# EAGLE design adc (EAGLE 4.16)
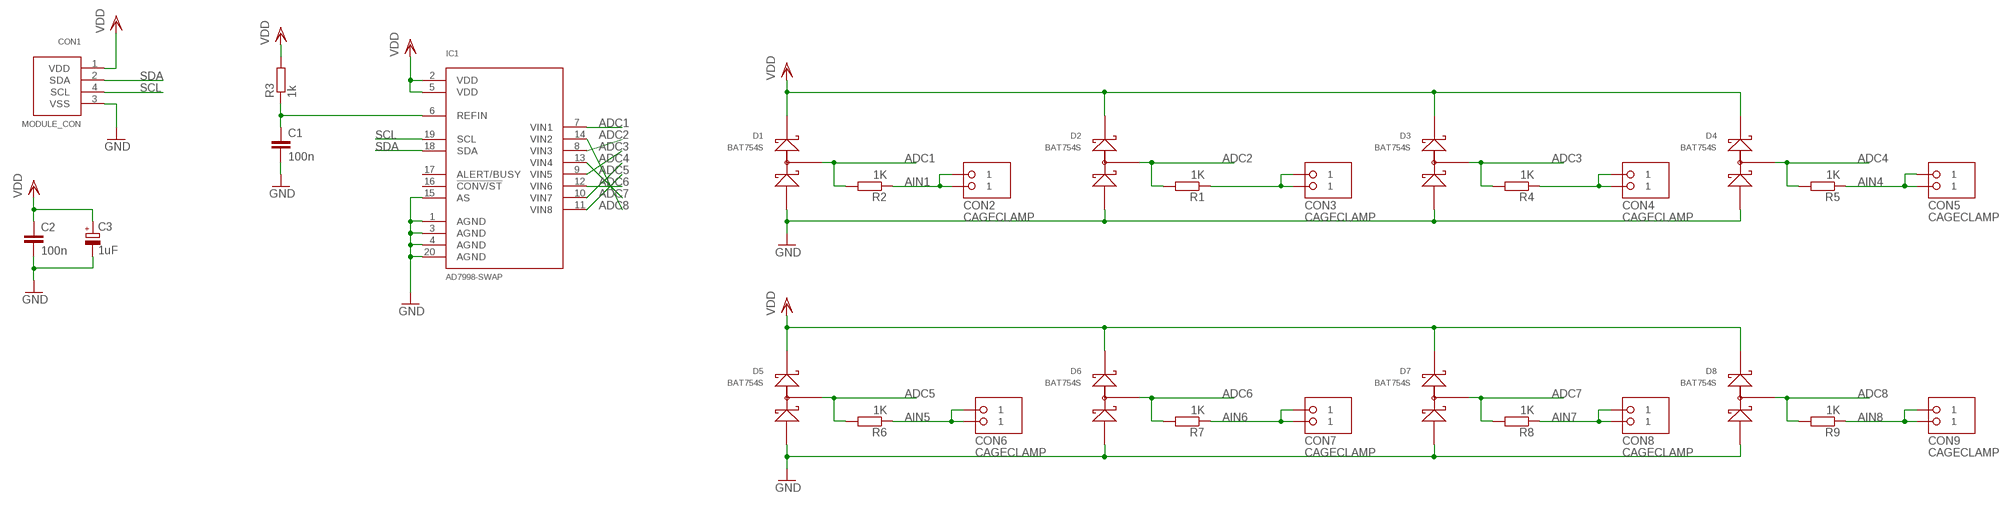
[diagram p0: schematic, sheet 1]

## Parts
C1  100n  C-EUC0603  [C0603]
C2  100n  C-EUC0603  [C0603]
C3  1uF  CPOL-EUB45181A  [B45181A]
CON1  MODULE_CON  [RJ11]
CON2  CAGECLAMP  [CAGECLAMP]
CON3  CAGECLAMP  [CAGECLAMP]
CON4  CAGECLAMP  [CAGECLAMP]
CON5  CAGECLAMP  [CAGECLAMP]
CON6  CAGECLAMP  [CAGECLAMP]
CON7  CAGECLAMP  [CAGECLAMP]
CON8  CAGECLAMP  [CAGECLAMP]
CON9  CAGECLAMP  [CAGECLAMP]
D1  BAT754S  [SOT23]
D2  BAT754S  [SOT23]
D3  BAT754S  [SOT23]
D4  BAT754S  [SOT23]
D5  BAT754S  [SOT23]
D6  BAT754S  [SOT23]
D7  BAT754S  [SOT23]
D8  BAT754S  [SOT23]
IC1  AD7998-SWAP  [TSSOP20]
R1  1K  R-EU_M1206  [M1206]
R2  1K  R-EU_M1206  [M1206]
R3  1k  R-EU_M1206  [M1206]
R4  1K  R-EU_M1206  [M1206]
R5  1K  R-EU_M1206  [M1206]
R6  1K  R-EU_M1206  [M1206]
R7  1K  R-EU_M1206  [M1206]
R8  1K  R-EU_M1206  [M1206]
R9  1K  R-EU_M1206  [M1206]

## Nets
ADC1: D1.3(MID) IC1.7(VIN1) R2.2
ADC2: D2.3(MID) IC1.8(VIN3) R1.2
ADC3: D3.3(MID) IC1.9(VIN5) R4.2
ADC4: D4.3(MID) IC1.10(VIN7) R5.2
ADC5: D5.3(MID) IC1.11(VIN8) R6.2
ADC6: D6.3(MID) IC1.12(VIN6) R7.2
ADC7: D7.3(MID) IC1.13(VIN4) R8.2
ADC8: D8.3(MID) IC1.14(VIN2) R9.2
AIN1: CON2.1 CON2.2 R2.1
AIN4: CON5.1 CON5.2 R5.1
AIN5: CON6.1 CON6.2 R6.1
AIN6: CON7.1 CON7.2 R7.1
AIN7: CON8.1 CON8.2 R8.1
AIN8: CON9.1 CON9.2 R9.1
GND: C1.2 C2.2 C3.- CON1.3(VSS) D1.1(ANODE) D2.1(ANODE) D3.1(ANODE) D4.1(ANODE) D5.1(ANODE) D6.1(ANODE) D7.1(ANODE) D8.1(ANODE) IC1.1(AGND) IC1.3(AGND) IC1.4(AGND) IC1.15(AS) IC1.20(AGND)
N$1: CON3.1 CON3.2 R1.1
N$2: C1.1 IC1.6(REFIN) R3.1
N$3: CON4.1 CON4.2 R4.1
SCL: CON1.4(SCL) IC1.19(SCL)
SDA: CON1.2(SDA) IC1.18(SDA)
VDD: C2.1 C3.+ CON1.1(VDD) D1.2(CATHODE) D2.2(CATHODE) D3.2(CATHODE) D4.2(CATHODE) D5.2(CATHODE) D6.2(CATHODE) D7.2(CATHODE) D8.2(CATHODE) IC1.2(VDD) IC1.5(VDD) R3.2
Unconnected: IC1.16(!CONV/ST) IC1.17(ALERT/BUSY)

## Library data of the parts
C1 C2 = rcl:C-EU: CAPACITOR, European symbol
C3 = rcl:CPOL-EU: POLARIZED CAPACITOR, European symbol
CON1 = ecssr:MODULE_CON
CON2-CON9 = ecssr:CAGECLAMP
D1-D8 = ecssr:BAT754S
IC1 = ecssr:AD7998-SWAP
R1-R9 = rcl:R-EU_: RESISTOR, European symbol

## Board
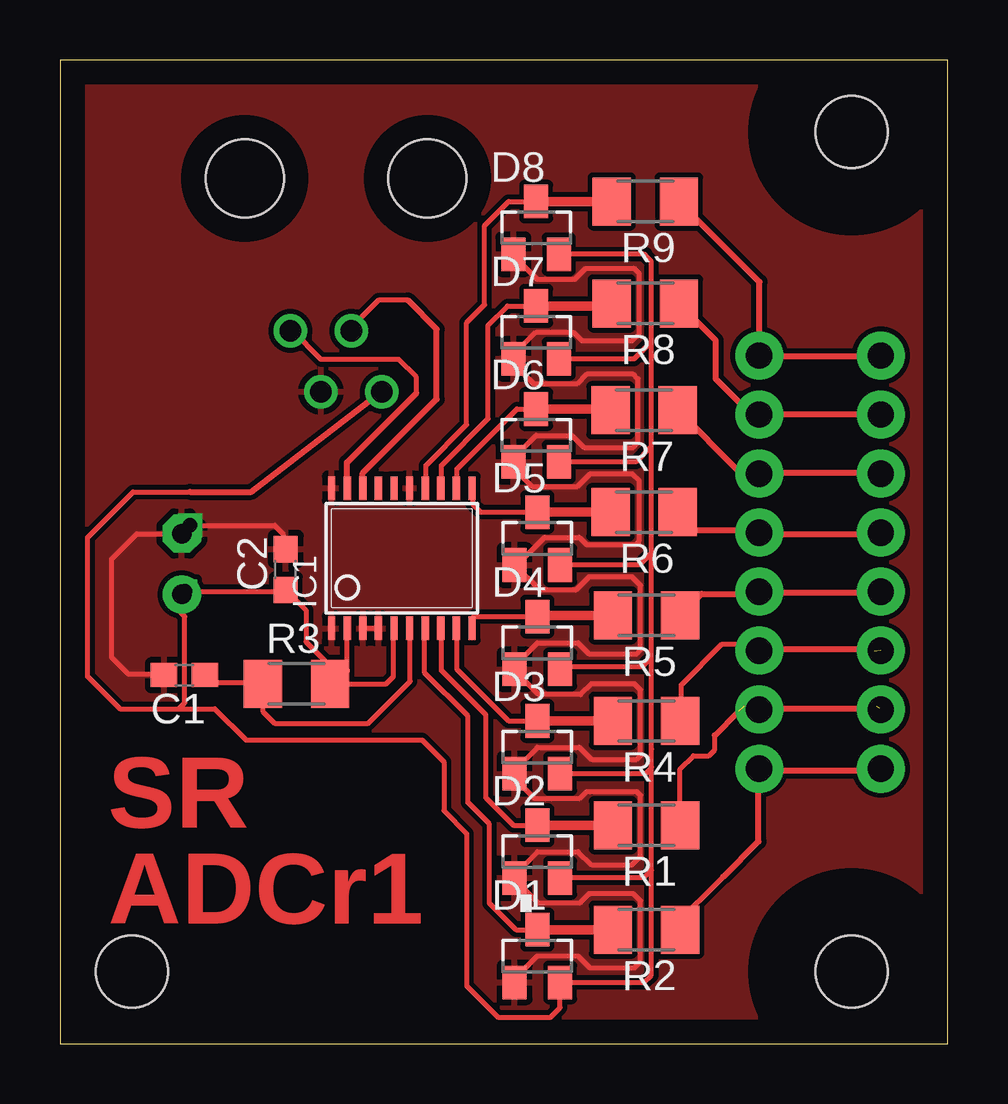
[diagram p1: board, top side]
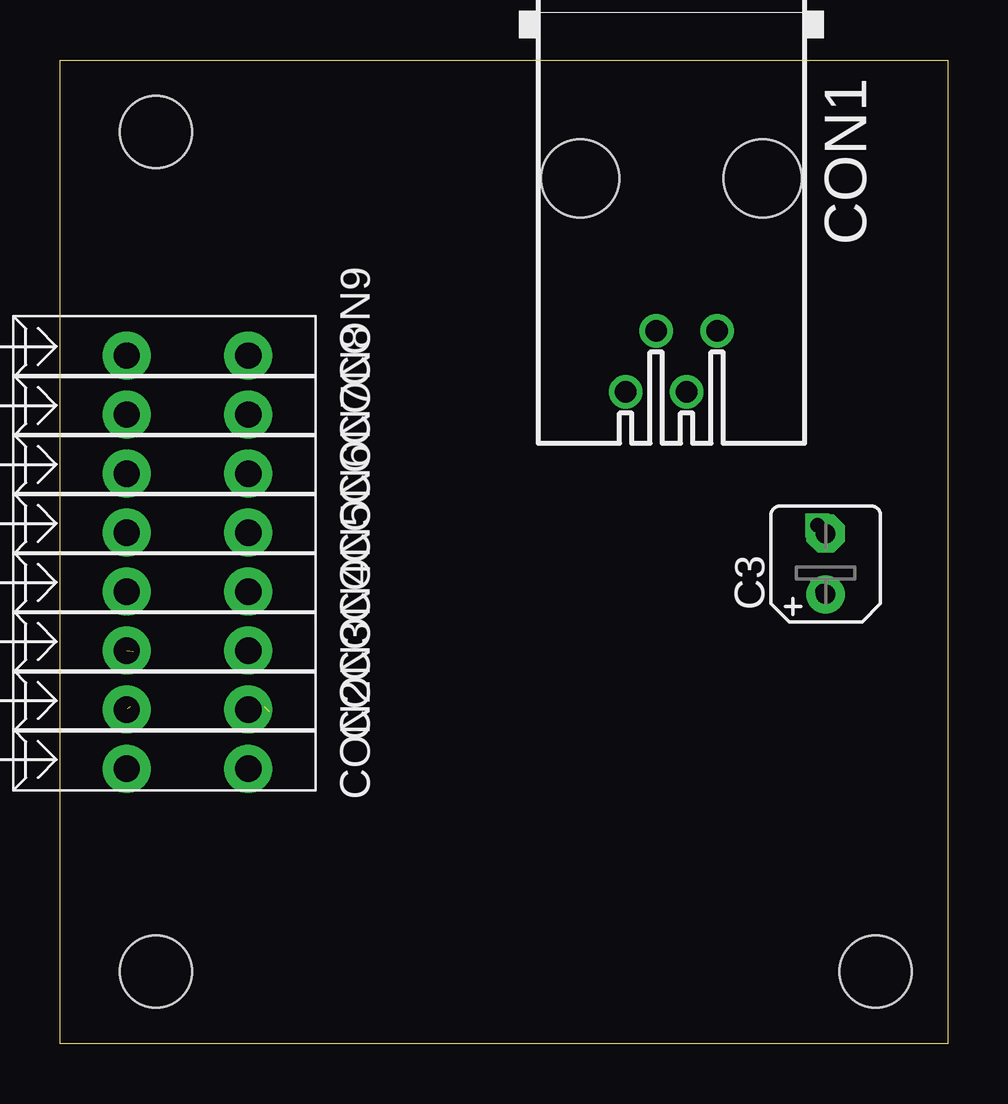
[diagram p2: board, bottom side, seen from below]

Size 37 x 41 mm. Coordinates in mm from the lower left corner, seen from the top.
Outline: 0,0 37,0 37,41 0,41 0,0
Copper layers (1*16): Top 0.035mm / dielectric 1.5mm / Bottom 0.035mm
Design rules "default": minimum track width 10mil, minimum drill 24mil, track to track 8mil, track to pad 8mil, pad to pad 8mil, via to via 8mil, smd to smd 8mil, copper to edge 40mil, drill to drill 8mil, minimum pad ring 10mil, minimum via ring 8mil, stop-mask expansion 4mil, vias tented up to drill 0mil, thermal gap 10mil
Holes 3 mm at 3,3 33,3 33,38
tRestrict: area 29,34 to 37,42; area 29,-1 to 37,7

### Footprints (pad centres in the part's own frame; a part is rotated, then mirrored left to right if it is on the bottom)
C0603 = smd 1.1 x 1: 1 -0.85,0; 2 0.85,0
B45181A = drill 0.813 pad 1.6 round: + -1.27,0 | drill 0.813 pad 1.6 octagon: - 1.27,0
RJ11-4P4C = drill 0.889 round: 1 1.905,8.89; 2 0.635,6.35; 3 -0.635,8.89; 4 -1.905,6.35 | hole 3.251: -3.81,0; 3.81,0
CAGECLAMP = drill 1.1 pad 2 round: 1 0,-0.01; 2 0,-5.08
SOT23 = smd 1 x 1.4: 1 -0.95,-1.1; 2 0.95,-1.1; 3 0,1.1
TSSOP20 = smd 0.305 x 0.991: 1 -2.925,-2.918; 2 -2.275,-2.918; 3 -1.625,-2.918; 4 -0.975,-2.918; 5 -0.325,-2.918; 6 0.325,-2.918; 7 0.975,-2.918; 8 1.625,-2.918; 9 2.275,-2.918; 10 2.925,-2.918; 11 2.925,2.918; 12 2.275,2.918; 13 1.625,2.918; 14 0.975,2.918; 15 0.325,2.918; 16 -0.325,2.918; 17 -0.975,2.918; 18 -1.625,2.918; 19 -2.275,2.918; 20 -2.925,2.918
M1206 = smd 1.6 x 2: 1 -1.4,0; 2 1.4,0

### Placement (x,y rotation side)
C1  5.19,15.36 180 top
C2  9.41,19.76 90 top
C3  5.08,19.99 90 bottom
CON1  MODULE_CON  [RJ11-4P4C]  11.51,36.06 180 bottom
CON2  34.23,11.46 90 bottom
CON3  34.23,13.92 90 bottom
CON4  34.23,16.38 90 bottom
CON5  34.23,18.84 90 bottom
CON6  34.23,21.3 90 bottom
CON7  34.23,23.76 90 bottom
CON8  34.23,26.22 90 bottom
CON9  34.23,28.68 90 bottom
D1  19.9,3.65 0 top
D2  19.9,8 0 top
D3  19.9,12.35 0 top
D4  19.9,16.7 0 top
D5  19.9,21.05 0 top
D6  19.85,25.35 0 top
D7  19.85,29.65 0 top
D8  19.85,34 0 top
IC1  14.25,20.23 0 top
R1  24.45,9.1 180 top
R2  24.45,4.75 180 top
R3  9.86,15 0 top
R4  24.45,13.45 180 top
R5  24.45,17.85 180 top
R6  24.35,22.15 180 top
R7  24.35,26.4 180 top
R8  24.4,30.85 180 top
R9  24.4,35.1 180 top

### Tracks (layer width: path | path; a pad name or v marks a point on that pad's centre or on a via)
ADC1
  Top 0.2: D1.3 19,4.75 17.9,5.85 17.9,9.15 17,10.05 17,13.65 15.2,15.45 15.2,17.15 15.25,17.2 15.23,17.23 IC1.7
  Top 0.4: D1.3 R2.2
ADC2
  Top 0.2: D2.3 18.9,9.1 17.75,10.25 17.75,13.7 15.9,15.55 15.9,17.1 15.88,17.12 IC1.8
  Top 0.4: D2.3 R1.2
ADC3
  Top 0.2: D3.3 18.7,13.45 16.55,15.6 16.55,17.25 16.52,17.27 IC1.9
  Top 0.4: D3.3 R4.2
ADC4
  Top 0.2: IC1.10 17.17,17.68 17.15,17.7 17.25,17.8 D4.3
  Top 0.4: 23.2,17.85 R5.2 19.95,17.85 D4.3
ADC5
  Top 0.2: D5.3 17.55,22.15 17.2,22.5 17.2,23.1 17.17,23.12 IC1.11
  Top 0.4: 23.05,22.15 R6.2 23.05,22.15 | 23.05,22.15 23.03,22.17 | D5.3 23.05,22.15
ADC6
  Top 0.2: R7.2 22.74,26.39 22.75,26.4 22.72,26.43 | D6.3 19.05,26.45 16.55,23.95 16.55,23.15 IC1.12
  Top 0.4: 23,26.45 R7.2 | D6.3 23,26.45 | 23,26.45 23.05,26.5
ADC7
  Top 0.2: R8.2 22.62,30.77 22.6,30.75 | D7.3 18.65,30.75 17.85,29.95 17.85,26.05 15.9,24.1 15.9,22.9 15.88,22.93 IC1.13
  Top 0.4: D7.3 22.6,30.75
ADC8
  Top 0.2: D8.3 18.7,35.1 17.7,34.1 17.7,30.8 16.95,30.05 16.95,25.8 15.25,24.1 15.25,23 15.23,23.02 IC1.14
  Top 0.4: 23.05,35.1 R9.2 D8.3
AIN1
  Top 0.2: 27.65,6.95 25.6,4.9 25.15,4.9 25.4,4.65 25.85,4.65 R2.1
  Top 0.25: 29.12,11.49 29.12,11.56 | 29.12,11.49 CON2.2 29.23,11.38 34.3,11.38 | 27.65,6.95 29.12,8.42 29.12,11.49 | 34.3,11.38 34.36,11.38 | 34.3,11.38 CON2.1
AIN4
  Top 0.25: R5.1 26.74,18.74 29.14,18.74 CON5.2 29.19,18.8 34.26,18.8 | 34.26,18.8 | 34.26,18.8 CON5.1
AIN5
  Top 0.25: CON6.2 29.16,21.4 26.5,21.4 R6.1 | CON6.2 | 34.28,21.24 | 34.28,21.24 CON6.1 | CON6.2 29.23,21.24 34.28,21.24
AIN6
  Top 0.25: 29.23,23.84 29.3,23.84 29.34,23.8 34.26,23.8 | CON7.2 29.23,23.84 | R7.1 28.31,23.84 29.23,23.84 | 34.26,23.8 34.34,23.8 | 34.26,23.8 CON7.1
AIN7
  Top 0.25: R8.1 27.34,29.31 27.34,27.7 28.8,26.24 29.13,26.24 | CON8.2 29.13,26.24 | 34.24,26.24 34.68,26.24 | 34.24,26.24 CON8.1 | 29.13,26.24 34.24,26.24
AIN8
  Top 0.25: CON9.2 | R9.1 29.16,31.74 CON9.2 | 34.24,28.66 34.56,28.66 | 34.24,28.66 CON9.1 | CON9.2 29.18,28.66 34.24,28.66
GND  (via drill 0.6)
  Top 0.2: 20.75,29.65 19.85,29.65 18.9,28.7 18.9,28.53 | 20.75,29.65 20.85,29.65 | 18.9,28.53 18.9,28.5 | 18.9,28.53 D7.1 18.8,28.45 19.75,27.5 21.55,27.5 21.95,27.9 23.9,27.9 24.1,27.7 24.1,25.05 23.9,24.85 21.85,24.85 21.35,25.35 19.85,25.35 18.89,24.39 D6.1 18.89,24.01 19.7,23.2 21.55,23.2 22.1,23.75 23.85,23.75 24.15,23.45 24.15,20.95 24,20.8 21.95,20.8 21.65,21.1 20.2,21.1 19.3,20.2 19.3,19.98 D5.1 20.01,18.9 21.5,18.9 22.05,19.45 23.85,19.45 24.2,19.1 24.2,16.4 24.05,16.25 22.05,16.25 21.6,16.7 19.9,16.7 18.9,15.7 18.9,15.65 | 19.25,33 19.25,32.97 D8.1 | 20.75,29.65 21.4,29.65 21.75,29.3 23.85,29.3 24.15,29.6 24.15,32.1 23.95,32.3 21.9,32.3 21.45,31.85 19.9,31.85 19.25,32.5 19.25,33.32 | 19.25,33.32 19.25,33.35 | 19.25,33.32 D8.1 | 18.9,15.65 D4.1 | 18.9,15.65 18.9,15.6 19.95,14.55 21.7,14.55 22.15,15 23.95,15 24.2,14.75 24.2,12 24.05,11.85 22.15,11.85 21.65,12.35 19.9,12.35 18.95,11.4 D3.1 18.95,11.05 19.8,10.2 21.65,10.2 21.95,10.5 24.05,10.5 24.2,10.35 24.2,7.8 23.85,7.45 22.15,7.45 21.6,8 19.9,8 18.95,7.05 D2.1 18.95,6.85 19.95,5.85 21.65,5.85 22.05,6.25 23.9,6.25 24.2,5.95 24.2,3.4 23.95,3.15 22.1,3.15 21.6,3.65 19.9,3.65 18.9,2.65 18.95,2.6 D1.1 18.9,2.6 | D8.1 19.05,33.05 19.05,33.2 | IC1.4 12.64,17.3 IC1.3 | v5.42,21.6 8.95,21.6 9.3,21.25 9.3,20.7 9.32,20.7 C2.2 | v5.07,21.25 3.2,21.25 2.15,20.2 2.15,16.1 2.85,15.4 4.3,15.4 C1.2
  Bottom 0.2: v5.42,21.6 C3.- v5.07,21.25
  pour Top (isolate 0.2): -2,44 41,44 41,-3 -2,-3
N$1  (2 unrouted)
  Top 0.2: R1.1 25.85,11.45 26.4,12 27.05,12 27.3,12.25 27.3,12.85 | 28.5,14.05 28.72,14.05 | 33.76,14.26 33.8,14.3 34.05,14.05
  Top 0.25: 29.23,13.84 29.28,13.84 29.4,13.96 34.18,13.96 CON3.1 | 29.23,13.84 CON3.2 | 27.3,12.85 28.29,13.84 29.23,13.84
N$2
  Top 0.2: IC1.6 14.58,17.27 14.6,17.25 14.6,15.1 12.85,13.35 8.95,13.35 8.45,13.85 8.45,15.15 8.46,15.14 R3.1 | R3.1 8.6,14.86 | 8.51,15.05 8.7,15.05 | 8.51,15.05 R3.1 | C1.1 6.35,15.05 8.51,15.05
N$3  (1 unrouted)
  Top 0.2: R4.1 25.9,13.5 25.9,14.95 27.6,16.65 28.66,16.65 | 33.95,16.35 33.76,16.54
  Top 0.25: 28.66,16.65 29.05,16.26 29.08,16.26 29.08,16.31 CON4.2 29.21,16.44 34.28,16.44 | 34.28,16.44 34.3,16.44 | 34.28,16.44 CON4.1
SCL
  Top 0.2: 14.86,27.12 14.86,27.78 14.12,28.52 10.88,28.52 9.69,29.71 CON1.4
  Top 0.25: 14.86,27.12 11.96,24.22 11.96,23.2 11.98,23.18 IC1.19
SDA
  Top 0.2: 12.65,23.15 IC1.18 | 12.6,23.4 12.62,23.38 IC1.18 | 12.6,23.6 12.62,23.57 IC1.18 | CON1.2 12.15,29.8 12.12,29.82 13.28,30.98 14.5,30.98
  Top 0.25: 14.5,30.98 15.7,29.78 15.7,26.86 12.62,23.78 12.62,23.4 12.58,23.36 12.62,23.32 IC1.18
VDD  (via drill 0.6)
  Top 0.2: 20.8,28.53 20.8,28.5 | 20.8,28.53 D7.2 | 24.65,29.15 24.6,29.2 23.93,28.53 20.8,28.53 | 21.15,33.05 21,33.2 21.11,33.31 D8.2 20.85,32.95 20.9,32.9 24.35,32.9 | D6.2 24,24.25 24.6,24.85 24.65,24.75 | 24.65,24.75 24.65,29.15 | D5.2 24.15,19.95 24.65,20.45 24.65,20.5 | 24.65,20.5 24.65,24.75 | D4.2 20.91,15.7 24.25,15.7 24.65,16.1 | 24.65,16.1 24.65,20.5 | 24.65,12.3 24.65,16.1 | 24.65,12.3 24.65,12.25 | D3.2 24.4,11.25 24.65,11.5 24.65,11.55 | 24.65,11.55 24.65,12.3 | 24.65,7.25 24.65,7.2 24.35,6.9 D2.2 | 24.65,7.25 24.65,11.55 | 24.65,7.25 24.65,2.85 24.35,2.55 D1.2 20.85,1.5 20.45,1.1 18.25,1.1 16.95,2.4 16.95,8.75 16,9.7 16,11.75 15.1,12.65 7.75,12.65 6.45,13.95 4.95,13.95 | 24.65,29.15 24.65,32.6 24.35,32.9 | R3.2 11.26,14.86 arc-90 11.25,14.85 arc90 11.98,15.57 IC1.2 | 24.35,32.9 24.4,32.9 | IC1.5 13.9,17.29 13.9,15.3 13.6,15 R3.2 | R3.2 11.41,14.85 11.6,14.85 11.6,15.4 10.25,16.75 10.25,18.07 C2.1 9.35,18.85 v5.21,18.85 | 5.5,23 5.42,23 3.05,23 1.15,21.1 1.15,15.3 2.5,13.95 4.95,13.95 | 4.95,13.95 5.2,14.2 5.2,17.8 5.05,17.95 v5.05,18.69
  Top 0.25: CON1.1 7.98,23 5.42,23
  Bottom 0.2: v5.21,18.85 C3.+ v5.05,18.69

### Text on the board
Top: SR | ADCr1